# Altium schematic sheet Switches.SchDoc
size 420 x 297 mm; SheetNumber: 1; SheetTotal: 4
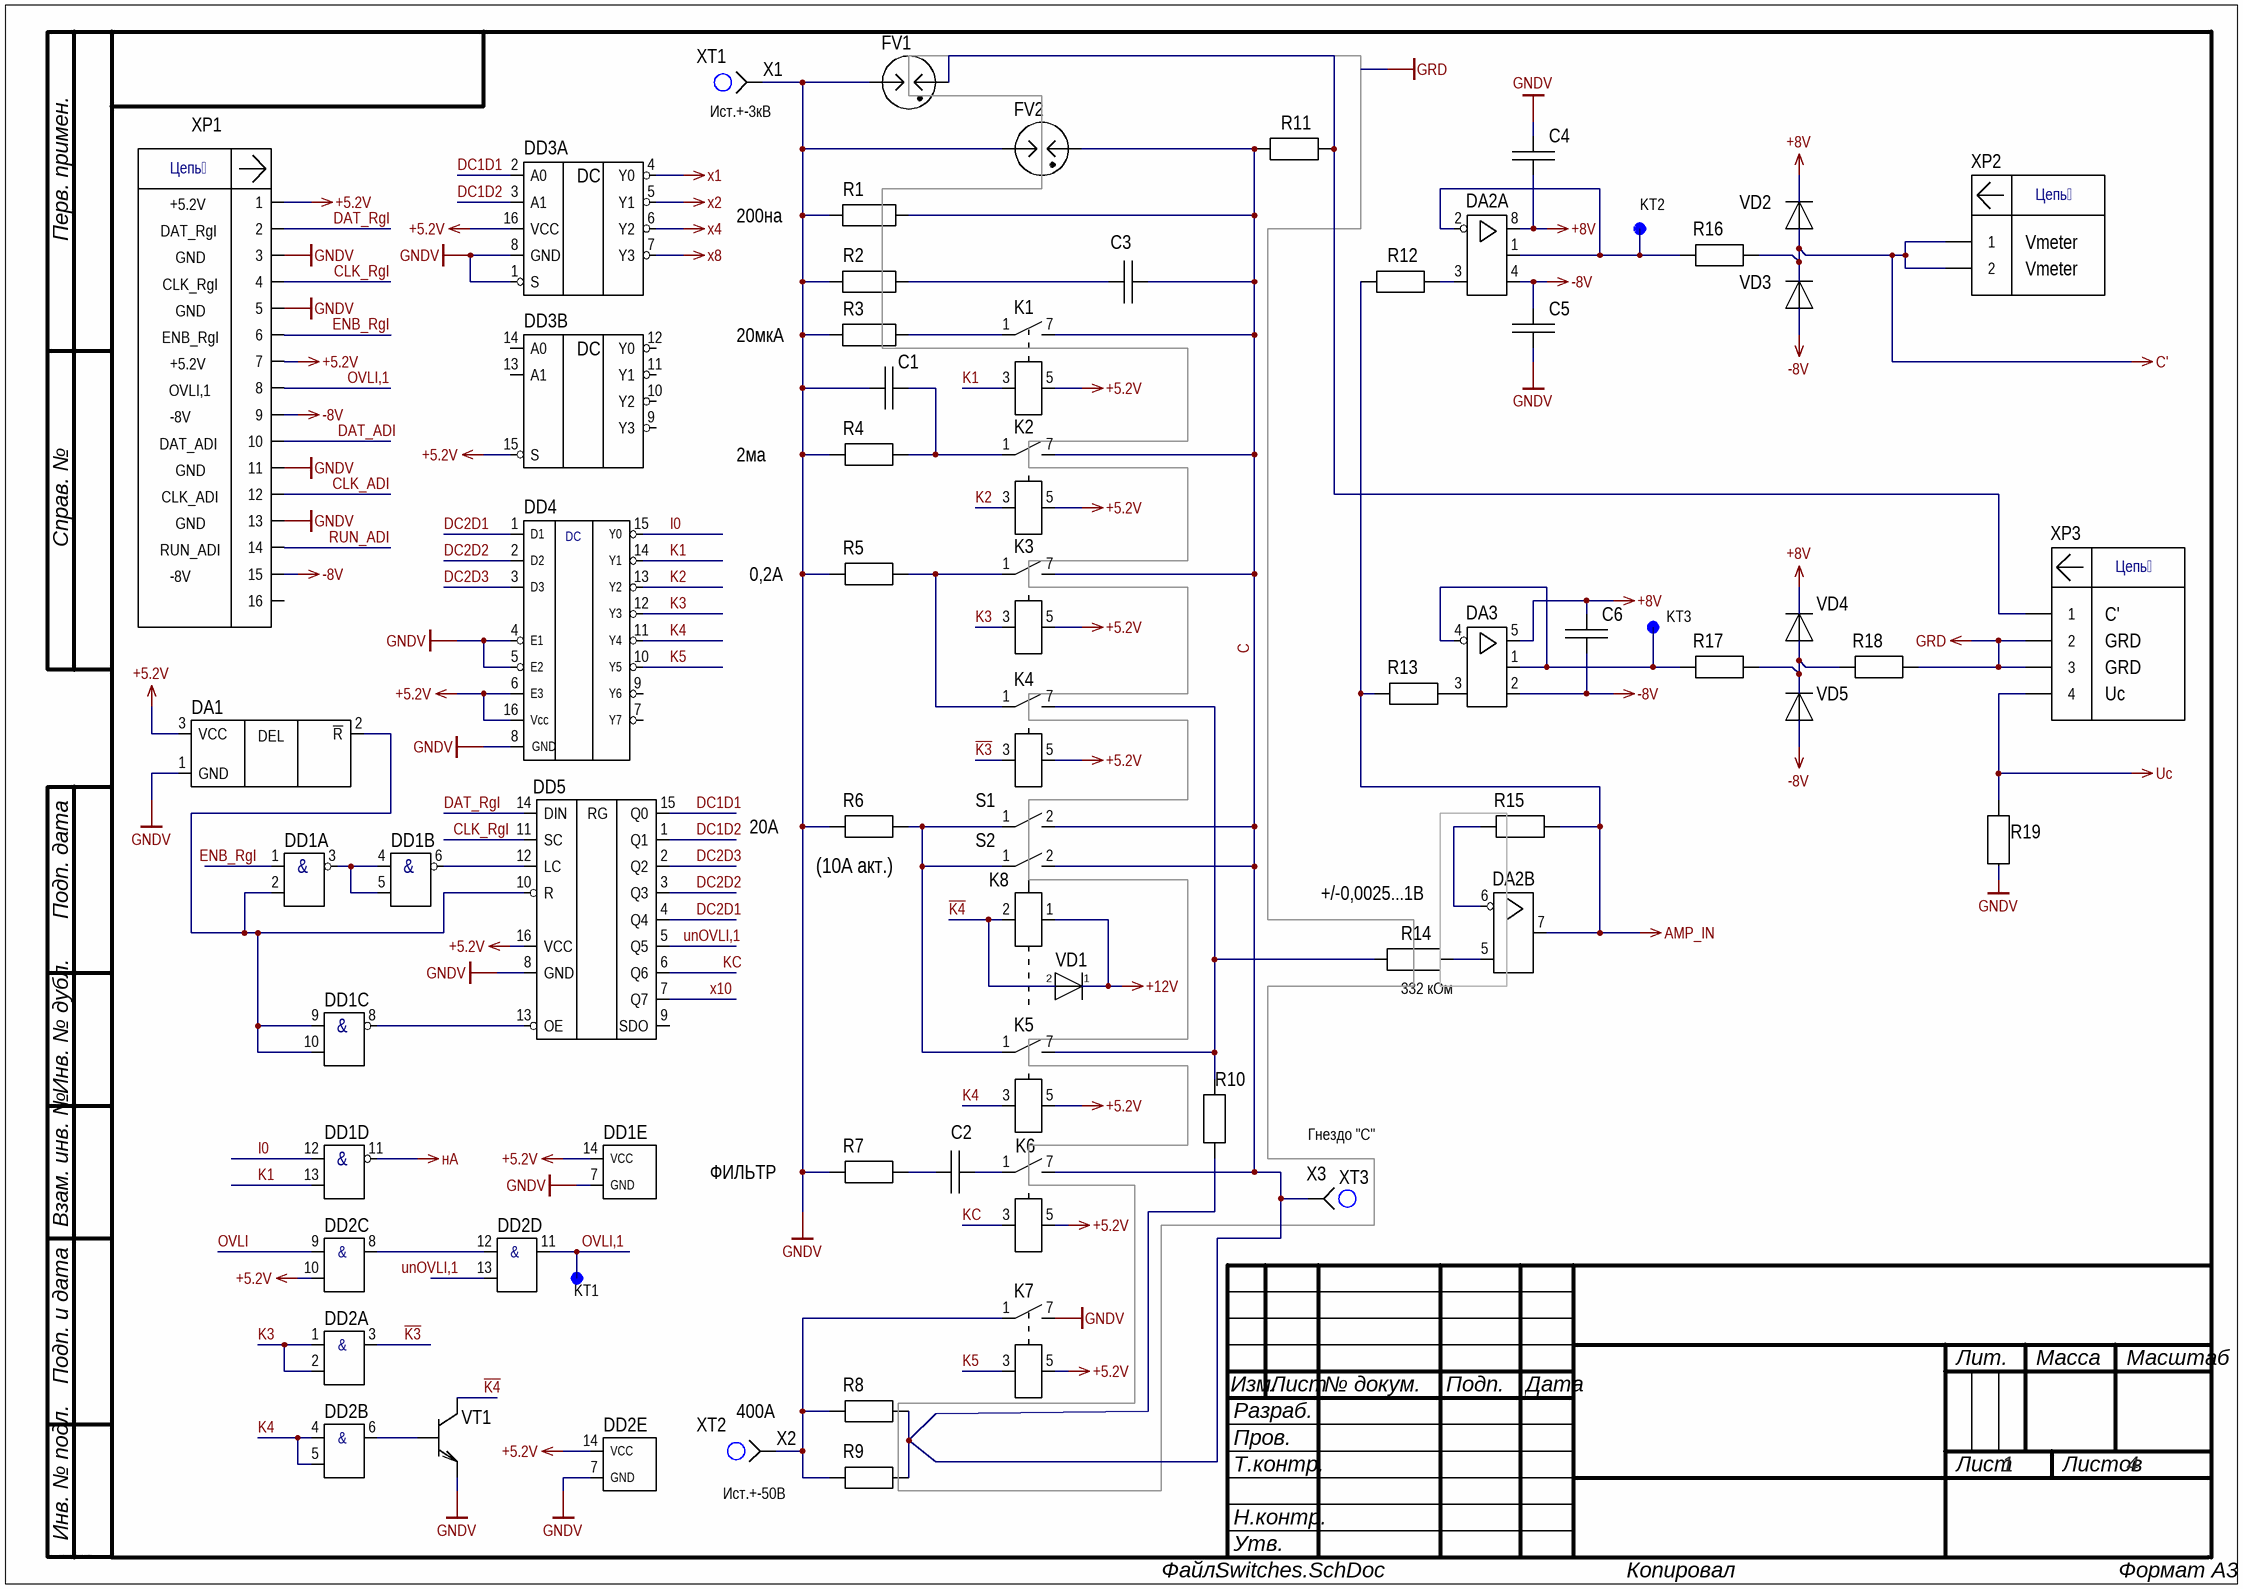
[diagram p0: Switches.SchDoc]

## Parts
C1  1206-XP7-630 B-3,3 нФ+-10%  [CAP: 1206]  (value not drawn)
C2  1206-XP7-500 B-15 нФ+-10%  [CAP: 1206]  (value not drawn)
C3  1206-NP0-500 B-270 пФ+-5%  [CAP: 1206]  (value not drawn)
C4  1206-X7R-50 B-0,1 мкФ+-10%  [CAP: 1206]  (value not drawn)
C5  1206-X7R-50 B-0,1 мкФ+-10%  [CAP: 1206]  (value not drawn)
C6  1206-X7R-50 B-0,1 мкФ+-10%  [CAP: 1206]  (value not drawn)
DA1  MAX809S  [SOT-23-3]  (value not drawn)
DA2  TLV9152IDR  [8-SOIC]  (value not drawn)  (parts A,B of 2)
DA3  TLV9151IDR  [SOT-23-5]  (value not drawn)
DD1  IN74HC00AD  [14-soic]  (value not drawn)  (parts A,B,C,D,E of 5)
DD2  IN74HC08AD  [14-SOIC]  (value not drawn)  (parts A,B,C,D,E of 5)
DD3  IN74HC139AD  [16-SOIC]  (value not drawn)  (parts A,B of 2)
DD4  IN74HC138AD  [16-SOIC]  (value not drawn)
DD5  IN74HC595AD  [16-SOIC]  (value not drawn)
FV1  2027-09-B19  [2027-09-B19]  (value not drawn)
FV2  2027-09-B19  [2027-09-B19]  (value not drawn)
K1  SIL05-1A72-71L  [SIL051A7271L]  (value not drawn)
K2  SIL05-1A72-71L  [SIL051A7271L]  (value not drawn)
K3  SIL05-1A72-71L  [SIL051A7271L]  (value not drawn)
K4  SIL05-1A72-71L  [SIL051A7271L]  (value not drawn)
K5  SIL05-1A72-71L  [SIL051A7271L]  (value not drawn)
K6  SIL05-1A72-71L  [SIL051A7271L]  (value not drawn)
K7  SIL05-1A72-71L  [SIL051A7271L]  (value not drawn)
K8  УШЯИ.685442.092vs2Rel  [УШЯИ.685442.092vs2Rel]  (value not drawn)
KT1  OTV10  [OTV10]  (value not drawn)  (no BOM)
KT2  OTV10  [OTV10]  (value not drawn)  (no BOM)
KT3  OTV10  [OTV10]  (value not drawn)  (no BOM)
R1  С2-29В-0,25-4,99 МОм +-0.1%  [С2-29В-0,25(140.02.0204.00.00)]  (value not drawn)
R2  С2-29В-0,125-22 Ом +-0.1%-1,0-А  [С2-29В-0,125(140.02.0202.00.00)]  (value not drawn)
R3  С2-29В-0,125-49,9 кОм +-0.1%-1,0-А  [С2-29В-0,125(140.02.0202.00.00)]  (value not drawn)
R4  1206-499 Ом+-0,1%  [1206]  (value not drawn)
R5  1206-4,99 Ом+-0,1%  [1206]  (value not drawn)
R6  OAR5-R050FLF  [OAR5]  (value not drawn)
R7  1206-27 Ом+-5%  [1206]  (value not drawn)
R8  WSL5931L5000FEA  [WSL5931L5000FEA]  (value not drawn)
R9  WSL5931L5000FEA  [WSL5931L5000FEA]  (value not drawn)
R10  1206-91 кОм+-5%  [1206]  (value not drawn)
R11  1210-100 Ом+-5%  [1210]  (value not drawn)
R12  1206-470 Ом+-5%  [1206]  (value not drawn)
R13  1206-470 Ом+-5%  [1206]  (value not drawn)
R14  С2-29В-0,125-332 кОм+-0.1%-1,0-А  [С2-29В-0,125(140.02.0202.00.00)]  (value not drawn)
R15  1206-470 Ом+-5%  [1206]  (value not drawn)
R16  1206-51 Ом+-5%  [1206]  (value not drawn)
R17  1206-22 Ом+-5%  [1206]  (value not drawn)
R18  1206-22 Ом+-5%  [1206]  (value not drawn)
R19  1210-1,1 кОм+-5%  [1210]  (value not drawn)
S1  DRA282G  (value not drawn)
S2  DRA282G  (value not drawn)
VD1  1N4148WS  [SOD-323F]  (value not drawn)
VD2  1N4007WS  [SOD-323]  (value not drawn)
VD3  1N4007WS  [SOD-323]  (value not drawn)
VD4  1N4007WS  [SOD-323]  (value not drawn)
VD5  1N4007WS  [SOD-323]  (value not drawn)
VT1  FZT658  [SOT-23-4]  (value not drawn)
X1  TR-1,25-4  (value not drawn)
X2  TR-1,25-4  (value not drawn)
X3  TR-1,25-4  (value not drawn)
XP1  DS1014-16SF1B  [DS1014-16S]  (value not drawn)
XP2  280370-2  [280370-2]  (value not drawn)
XP3  280371-2  [280371-2]  (value not drawn)
XT1  УШЯИ.685631.123  [УШЯИ.685631.123]  (value not drawn)  (no BOM)
XT2  УШЯИ.685631.123  [УШЯИ.685631.123]  (value not drawn)  (no BOM)
XT3  УШЯИ.685631.123  [УШЯИ.685631.123]  (value not drawn)  (no BOM)

## Nets
+5.2V: DA1.3(VCC) DD1.14(VCC) DD2.10(B3) DD2.14(VCC) DD3.15(S) DD3.16(VCC) DD4.6(E3) DD4.16(Vcc) DD5.16(VCC) K1.5(COIL_2) K2.5(COIL_2) K3.5(COIL_2) K4.5(COIL_2) K5.5(COIL_2) K6.5(COIL_2) K7.5(COIL_2) XP1.1 XP1.7
+8V: C4.1 C6.2 DA2.8(Vs+) DA3.5(Vs+) VD2.1 VD4.1
+12V: K8.1(COIL_1) VD1.1
-8V: C5.2 C6.1 DA2.4(Vs-) DA3.2(Vs-) VD3.2 VD5.2 XP1.9 XP1.15
AMP_IN: DA2.7(OUT) R12.2 R13.2 R15.2
C': R16.2 VD2.2 VD3.1 XP2.1 XP2.2
GNDV: C1.1 C4.2 C5.1 DA1.1(GND) DD1.7(GND) DD2.7(GND) DD3.1(S) DD3.8(GND) DD4.4(E1) DD4.5(E2) DD4.8(GND) DD5.8(GND) FV1.1 FV2.1 K7.7(COM) R1.1 R2.1 R3.1 R4.1 R5.1 R6.1 R7.1 R19.1 VT1.3(E) X1.1 XP1.3 XP1.5 XP1.11 XP1.13
GRD: R18.2 XP3.2 XP3.3
Uc: R19.2 XP3.4
x1: DD3.4(Y0)
x2: DD3.5(Y1)
x4: DD3.6(Y2)
x8: DD3.7(Y3)
нА: DD1.11(Y4)
~{K3}: DD2.3(Y1) K4.3(COIL_1)
~{K4}: K8.2(COIL_2) VD1.2 VT1.2(C)
C: C3.2 FV2.2 K1.7(COM) K2.7(COM) K3.7(COM) K6.7(COM) R1.2 R8.2 R9.2 R10.1 R11.1 S1.2(COM) S2.2(COM) X3.1
CLK_ADI: XP1.12
CLK_RgI: DD5.11(SC) XP1.4
DAT_ADI: XP1.10
DAT_RgI: DD5.14(DIN) XP1.2
DC1D1: DD3.2(A0) DD5.15(Q0)
DC1D2: DD3.3(A1) DD5.1(Q1)
DC2D1: DD4.1(D1) DD5.4(Q4)
DC2D2: DD4.2(D2) DD5.3(Q3)
DC2D3: DD4.3(D3) DD5.2(Q2)
ENB_RgI: DD1.1(A1) XP1.6
I0: DD1.12(A4) DD4.15(Y0)
K1: DD1.13(B4) DD4.14(Y1) K1.3(COIL_1)
K2: DD4.13(Y2) K2.3(COIL_1)
K3: DD2.1(A1) DD2.2(B1) DD4.12(Y3) K3.3(COIL_1)
K4: DD2.4(A2) DD2.5(B2) DD4.11(Y4) K5.3(COIL_1)
K5: DD4.10(Y5) K7.3(COIL_1)
KC: DD5.6(Q6) K6.3(COIL_1)
OVLI: DD2.9(A3)
OVLI,1: DD2.11(Y4) KT1.1 XP1.8
RUN_ADI: XP1.14
unOVLI,1: DD2.13(B4) DD5.5(Q5)
x10: DD5.7(Q7)
NetC1_2: C1.2 K2.1(NO) R4.2
NetC2_1: C2.1 R7.2
NetC2_2: C2.2 K6.1(NO)
NetC3_1: C3.1 R2.2
NetDA1_2: DA1.2(~{R}) DD1.2(B1) DD1.9(A3) DD1.10(B3) DD5.10(R)
NetDA2_1: DA2.1(OUT) DA2.2(-IN) KT2.1 R16.1
NetDA2_3: DA2.3(+IN) R12.1
NetDA2_5: DA2.5(+IN) R14.1
NetDA2_6: DA2.6(-IN) R15.1
NetDA3_1: DA3.1(OUT) DA3.4(-IN) KT3.1 R17.1
NetDA3_3: DA3.3(+IN) R13.1
NetDD1_3: DD1.3(Y1) DD1.4(A2) DD1.5(B2)
NetDD1_6: DD1.6(Y2) DD5.12(LC)
NetDD1_8: DD1.8(Y3) DD5.13(OE)
NetDD2_6: DD2.6(Y2) VT1.1(B)
NetDD2_8: DD2.8(Y3) DD2.12(A4)
NetFV1_2: FV1.2 R11.2 XP3.1
NetK1_1: K1.1(NO) R3.2
NetK3_1: K3.1(NO) K4.1(NO) R5.2
NetK4_7: K4.7(COM) K5.7(COM) R10.2 R14.2
NetK5_1: K5.1(NO) R6.2 S1.1(NO) S2.1(NO)
NetK7_1: K7.1(NO) R8.1 R9.1 X2.1
NetR17_2: R17.2 R18.1 VD4.2 VD5.1

Not connected (* = marked no-connect by the designer): DD3 9(Y3) 10(Y2) 11(Y1) 12(Y0) 13(A1) 14(A0); DD4 7(Y7) 9(Y6); DD5 9(SDO); XP1 16

## Notes on the sheet
- Ист.+-3кВ
- (near XP1) DAT_RgI
- +5.2V
- 200на
- (near XP2) Vmeter
- (near XP1) CLK_RgI
- GND
- (near XP1) ENB_RgI
- (near XP1) OVLI,1
- 20мкА
- (near XP1) DAT_ADI
- -8V
- 2ма
- (near XP1) CLK_ADI
- (near XP1) RUN_ADI
- (near R5) 0,2А
- (near XP3) GRD
- (near XP3) C'
- (near XP3) Uc
- 20А
- (near R6) (10А акт.)
- (near DA2) +/-0,0025...1В
- (near R14) 332 кОм
- ФИЛЬТР
- Гнездо "C"
- 400А
- Ист.+-50В
- Перв. примен.
- Справ. №
- Подп. дата
- Инв. № дубл.
- Взам. инв. №
- Подп. и дата
- Изм.
- Разраб.
- Лист
- № докум.
- Подп.
- Дата
- Лит.
- Масса
- Масштаб
- Пров.
- Т.контр.
- Листов
- Инв. № подл.
- Н.контр.
- Утв.
- ALTIUM GOSTBOM2.0 KEV
- Файл:
- Копировал
- Формат А3
- (in symbol 280370-2) Цепь
- (in symbol 280371-2) Цепь
- (in symbol DS1014-16SF1B) Цепь
- (in symbol IN74HC00AD, part A) &
- (in symbol IN74HC00AD, part B) &
- (in symbol IN74HC00AD, part C) &
- (in symbol IN74HC00AD, part D) &
- (in symbol IN74HC08AD, part A) &
- (in symbol IN74HC08AD, part B) &
- (in symbol IN74HC08AD, part C) &
- (in symbol IN74HC08AD, part D) &
- (in symbol IN74HC138AD) DC
- (in symbol IN74HC139AD, part A) DC
- (in symbol IN74HC139AD, part B) DC
- (in symbol IN74HC595AD) RG
- (in symbol MAX809S) DEL

## Library data of the parts
C1 = 1206-XP7-630 B-3,3 нФ+-10%: Value: 3,3 нФ
C2 = 1206-XP7-500 B-15 нФ+-10%: Value: 15 нФ
C3 = 1206-NP0-500 B-270 пФ+-5%: Value: 22 пФ
C4-C6 = 1206-X7R-50 B-0,1 мкФ+-10%: Value: 0,1 мкФ
DA1 = MAX809S: Very Low Supply Current / 3-Pin Microprocessor Reset / Monitors
DD1 = IN74HC00AD: Quad 2-Input NAND Gate High-Performance Silicon-Gate CMOS.
DD2 = IN74HC08AD: Quad 2-Input AND Gate High-Performance Silicon-Gate CMOS
DD3 = IN74HC139AD: Decoder/Demultiplexer Dual 2-to-4
DD4 = IN74HC138AD: Дешифратор-демультиплексор IN74HC138A / 3-8 с инверсией на выходе
DD5 = IN74HC595AD: 8-Bit SIPO Register w/ Latch & 3-State
K1-K7 = SIL05-1A72-71L: Relay or Contactor
R1 = С2-29В-0,25-4,99 МОм +-0.1%: Резисторы постоянные непроволочные прецизионные С2-29В, производитель "АО"НПО"ЭРКОН""АО"НПО"ЭРКОН"; Номинальная мощность рассеяния: 0,25 Вт; Диапазон значений номинальных сопротивлений: от 1 Ом до 5,11 МОм; Ряд сопротивлений: Е192; Категории качества: ВП; ТУ: ОЖО.467.099 ТУ
R2 = С2-29В-0,125-22 Ом +-0.1%-1,0-А: Резисторы постоянные непроволочные прецизионные С2-29В, производитель "АО"НПО"ЭРКОН""АО"НПО"ЭРКОН"; Номинальная мощность рассеяния: 0,125 Вт; Диапазон значений номинальных сопротивлений: от 1 Ом до 1 МОм; Ряд сопротивлений: Е192; Категории качества: ВП; ТУ: ОЖО.467.099 ТУ
R3 = С2-29В-0,125-49,9 кОм +-0.1%-1,0-А: Резисторы постоянные непроволочные прецизионные С2-29В, производитель "АО"НПО"ЭРКОН""АО"НПО"ЭРКОН"; Номинальная мощность рассеяния: 0,125 Вт; Диапазон значений номинальных сопротивлений: от 1 Ом до 1 МОм; Ряд сопротивлений: Е192; Категории качества: ВП; ТУ: ОЖО.467.099 ТУ
R4 = 1206-499 Ом+-0,1%: Value: 499 Ом; ModelPrint: 1206
R5 = 1206-4,99 Ом+-0,1%: Value: 4,99 Ом; ModelPrint: 1206
R6 = OAR5-R050FLF: ModelPrint: 0402; Value: 0.05 Ом
R7 = 1206-27 Ом+-5%: Value: 27 Ом; ModelPrint: 1206
R8 R9 = WSL5931L5000FEA: ModelPrint: 1206; Value: 0,5 миллиОм
R10 = 1206-91 кОм+-5%: Value: 91 кОм; ModelPrint: 1206
R11 = 1210-100 Ом+-5%: ModelPrint: 1206; Value: 100 Ом
R12 R13 R15 = 1206-470 Ом+-5%: Value: 470 Ом; ModelPrint: 1206
R14 = С2-29В-0,125-332 кОм+-0.1%-1,0-А: Резисторы постоянные непроволочные прецизионные С2-29В, производитель "АО"НПО"ЭРКОН""АО"НПО"ЭРКОН"; Номинальная мощность рассеяния: 0,125 Вт; Диапазон значений номинальных сопротивлений: от 1 Ом до 1 МОм; Ряд сопротивлений: Е192; Категории качества: ВП; ТУ: ОЖО.467.099 ТУ
R16 = 1206-51 Ом+-5%: Value: 51 Ом; ModelPrint: 1206
R17 R18 = 1206-22 Ом+-5%: Value: 22 Ом; ModelPrint: 1206
R19 = 1210-1,1 кОм+-5%: ModelPrint: 1206; Value: 1,1 кОм
VD1 = 1N4148WS: Small Signal Fast Switching Diod; Value: *
VD2-VD5 = 1N4007WS: General Purpose Plastic Rectifier; Value: *
VT1 = FZT658: pin to pad: 2>2+4
X1-X3 = TR-1,25-4: Клемма TR-1,25-4
XP1 = DS1014-16SF1B: pitch 2mm, 16 pin 2x8, straight
XP2 = 280370-2: Connector
XP3 = 280371-2: Connector